# EasyEDA Pro project TC358870 HDMI2MIPI.epro, board PCB12
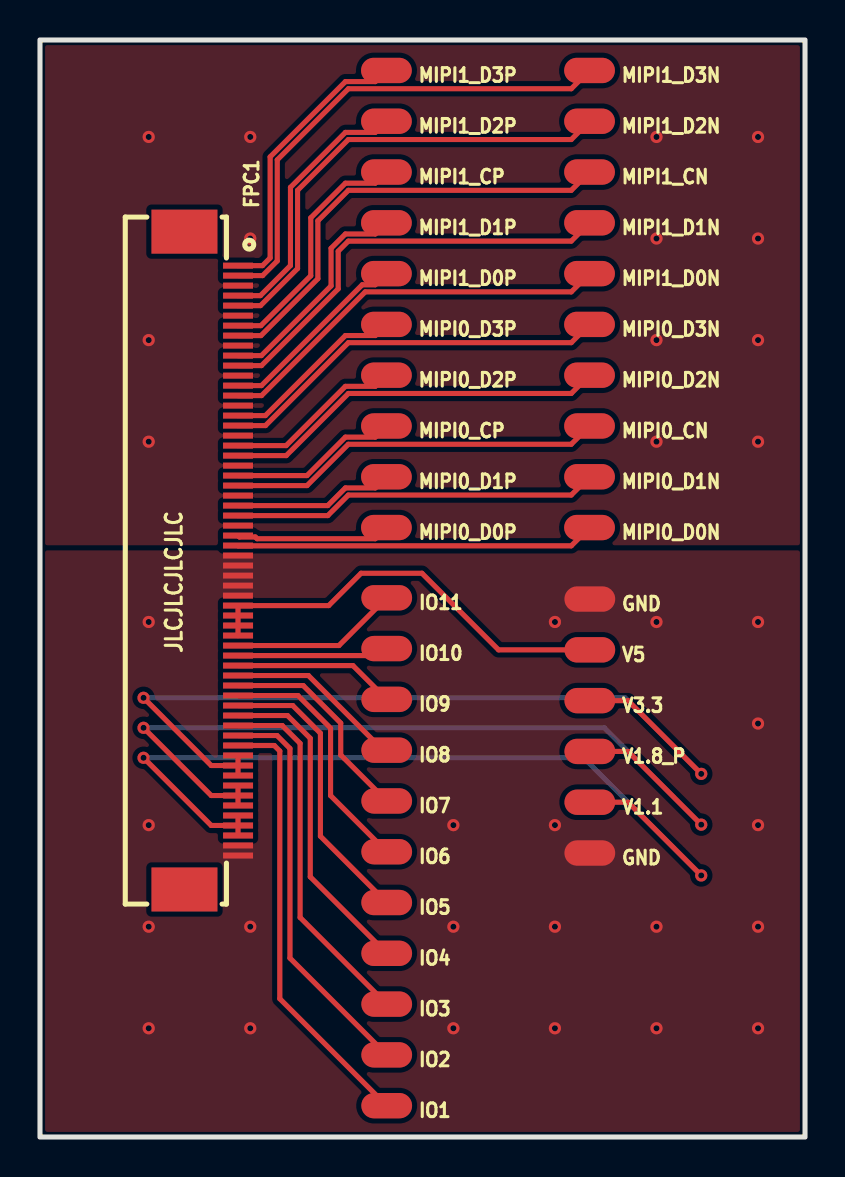
[diagram p6: board, top side]
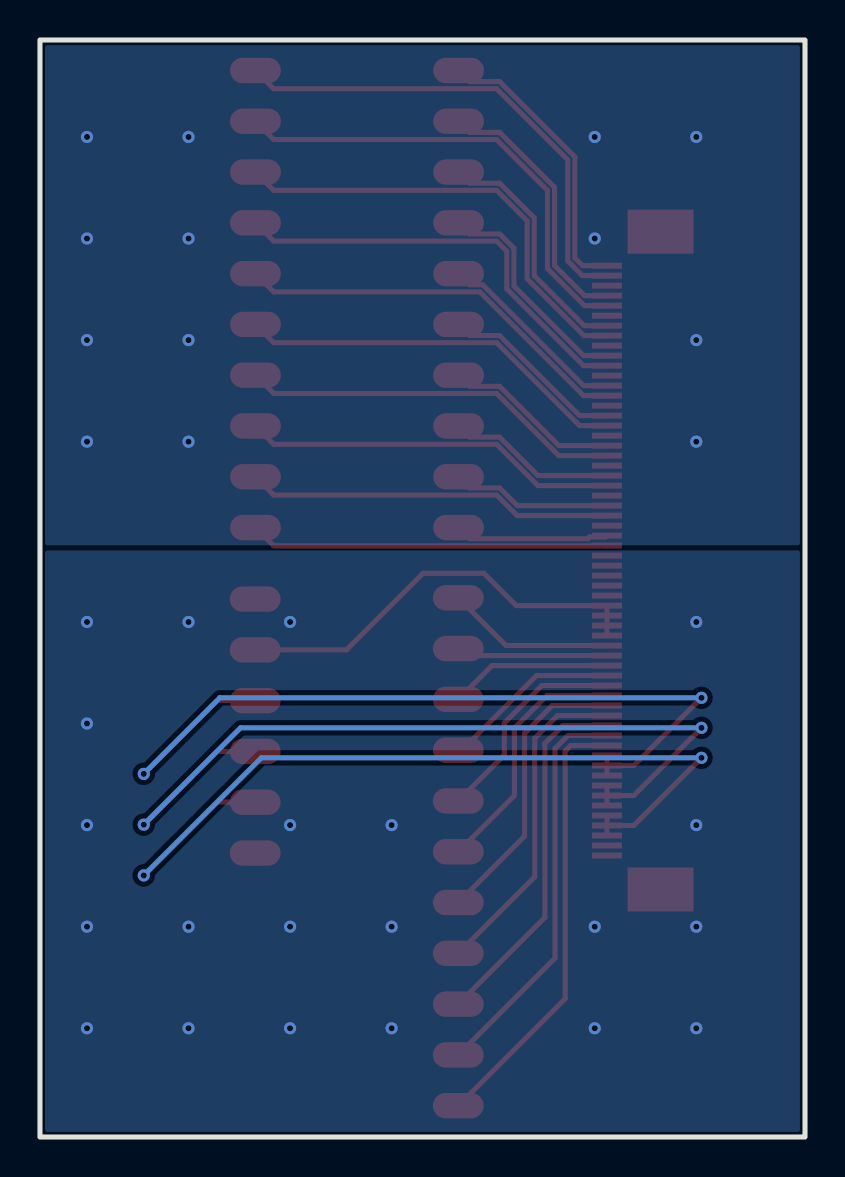
[diagram p7: board, bottom side, seen from below]

Outline 38.27 x 54.86 mm; copper layers: Top Layer, Bottom Layer. Coordinates in mm from the lower left corner of the outline.
Outline path: rectangle 0,54.86 38.27,0
Stack: Top Layer 0.035mm / Dielectric1 1.51mm FR4 er 4.5 / Bottom Layer 0.035mm

## Design rules (mm)
template: 自定义配置
spacing copperThickness1oz (default): track to track 0.102, other pairs 0.152 to 0.3
spacing copperThickness2oz: track to track 0.203, other pairs 0.152 to 0.3
track width copperThickness1oz (default): min 0.127, default 0.254, max 2.54
track width copperThickness2oz: min 0.203, default 0.254, max 2.54
differential pair differentialPair (default): width min 0.127, default 0.254, max 2.54; gap min 0.152, default 0.152
via viaSize (default): diameter min 0.5, default 0.61, max 10; hole min 0.3, default 0.305, max 6.3

## Placement (name value [footprint] x y rotation side)
FPC1  AFC01-S60FCA-00  [FPC-SMD_AFC01-S60FCC-00]  8.57 28.83 270 top
GND  -  [Test-Point-0.5mm]  27.5 26.9 0 top
GND#2  -  [Test-Point-0.5mm]  27.5 14.2 0 top
IO1  -  [Test-Point-0.5mm]  17.34 1.57 0 top
IO2  -  [Test-Point-0.5mm]  17.34 4.11 0 top
IO3  -  [Test-Point-0.5mm]  17.34 6.65 0 top
IO4  -  [Test-Point-0.5mm]  17.34 9.19 0 top
IO5  -  [Test-Point-0.5mm]  17.34 11.73 0 top
IO6  -  [Test-Point-0.5mm]  17.34 14.27 0 top
IO7  -  [Test-Point-0.5mm]  17.34 16.81 0 top
IO8  -  [Test-Point-0.5mm]  17.34 19.35 0 top
IO9  -  [Test-Point-0.5mm]  17.34 21.89 0 top
IO10  -  [Test-Point-0.5mm]  17.34 24.43 0 top
IO11  -  [Test-Point-0.5mm]  17.34 26.97 0 top
MIPI0_CN  -  [Test-Point-0.5mm]  27.49 35.56 0 top
MIPI0_CP  -  [Test-Point-0.5mm]  17.33 35.56 0 top
MIPI0_D0N  -  [Test-Point-0.5mm]  27.49 30.48 0 top
MIPI0_D0P  -  [Test-Point-0.5mm]  17.33 30.48 0 top
MIPI0_D1N  -  [Test-Point-0.5mm]  27.49 33.02 0 top
MIPI0_D1P  -  [Test-Point-0.5mm]  17.33 33.02 0 top
MIPI0_D2N  -  [Test-Point-0.5mm]  27.49 38.1 0 top
MIPI0_D2P  -  [Test-Point-0.5mm]  17.33 38.1 0 top
MIPI0_D3N  -  [Test-Point-0.5mm]  27.49 40.64 0 top
MIPI0_D3P  -  [Test-Point-0.5mm]  17.33 40.64 0 top
MIPI1_CN  -  [Test-Point-0.5mm]  27.49 48.26 0 top
MIPI1_CP  -  [Test-Point-0.5mm]  17.33 48.26 0 top
MIPI1_D0N  -  [Test-Point-0.5mm]  27.49 43.18 0 top
MIPI1_D0P  -  [Test-Point-0.5mm]  17.33 43.18 0 top
MIPI1_D1N  -  [Test-Point-0.5mm]  27.49 45.72 0 top
MIPI1_D1P  -  [Test-Point-0.5mm]  17.33 45.72 0 top
MIPI1_D2N  -  [Test-Point-0.5mm]  27.49 50.8 0 top
MIPI1_D2P  -  [Test-Point-0.5mm]  17.33 50.8 0 top
MIPI1_D3N  -  [Test-Point-0.5mm]  27.49 53.34 0 top
MIPI1_D3P  -  [Test-Point-0.5mm]  17.33 53.34 0 top
V1.1  -  [Test-Point-0.5mm]  27.5 16.74 0 top
V1.8_P  -  [Test-Point-0.5mm]  27.5 19.28 0 top
V3.3  -  [Test-Point-0.5mm]  27.5 21.82 0 top
V5  -  [Test-Point-0.5mm]  27.5 24.36 0 top

## Footprints (pads in the part's own frame, mm; a bottom-side part is the same pattern mirrored in y, then rotated)
FPC-SMD_AFC01-S60FCC-00
  rect 0.3x1.5 smd: 1(-14.75,1.34) 2(-14.251,1.34) 3(-13.751,1.34) 4(-13.25,1.34) 5(-12.75,1.34) 6(-12.249,1.34) 7(-11.749,1.34) 8(-11.25,1.34) 9(-10.751,1.34) 10(-10.251,1.34) 11(-9.75,1.34) 12(-9.249,1.34) 13(-8.749,1.34) 14(-8.25,1.34) 15(-7.75,1.34) 16(-7.25,1.34) 17(-6.75,1.34) 18(-6.25,1.34) 19(-5.75,1.34) 20(-5.249,1.34) 21(-4.749,1.34) 22(-4.251,1.34) 23(-3.751,1.34) 24(-3.25,1.34) 25(-2.75,1.34) 26(-2.249,1.34) 27(-1.749,1.34) 28(-1.25,1.34) 29(-0.751,1.34) 30(-0.251,1.34) 31(0.25,1.34) 32(0.75,1.34) 33(1.25,1.337) 34(1.751,1.337) 35(2.252,1.337) 36(2.749,1.34) 37(3.249,1.34) 38(3.75,1.34) 39(4.25,1.34) 40(4.751,1.34) 41(5.251,1.34) 42(5.749,1.34) 43(6.25,1.34) 44(6.75,1.34) 45(7.25,1.34) 46(7.75,1.34) 47(8.251,1.34) 48(8.75,1.34) 49(9.249,1.34) 50(9.749,1.34) 51(10.25,1.34) 52(10.751,1.34) 53(11.251,1.34) 54(11.751,1.34) 55(12.25,1.34) 56(12.749,1.34) 57(13.249,1.34) 58(13.75,1.34) 59(14.251,1.34) 60(14.751,1.34)
  rect 2.2x3.3 smd: 61(-16.45,-1.34) 62(16.45,-1.34)
Test-Point-0.5mm
  oval 2.54x1.27 smd: 1(0,0)

## Nets
GND: FPC1.30 FPC1.31 FPC1.32 FPC1.33 FPC1.34 FPC1.59 FPC1.60 GND.1 GND#2.1
GND_P: FPC1.3 FPC1.6 FPC1.9 FPC1.12 FPC1.15 FPC1.18 FPC1.21 FPC1.24 FPC1.27
V1.1: FPC1.56 FPC1.57 FPC1.58 V1.1.1
V1.8_P: FPC1.53 FPC1.54 FPC1.55 V1.8_P.1
V3.3: FPC1.50 FPC1.51 FPC1.52 V3.3.1
V5: FPC1.35 FPC1.36 FPC1.37 FPC1.38 V5.1
IO1: FPC1.49 IO1.1
IO2: FPC1.48 IO2.1
IO3: FPC1.47 IO3.1
IO4: FPC1.46 IO4.1
IO5: FPC1.45 IO5.1
IO6: FPC1.44 IO6.1
IO7: FPC1.43 IO7.1
IO8: FPC1.42 IO8.1
IO9: FPC1.41 IO9.1
IO10: FPC1.40 IO10.1
IO11: FPC1.39 IO11.1
MIPI0_CN: FPC1.23 MIPI0_CN.1
MIPI0_CP: FPC1.22 MIPI0_CP.1
MIPI0_D0N: FPC1.29 MIPI0_D0N.1
MIPI0_D0P: FPC1.28 MIPI0_D0P.1
MIPI0_D1N: FPC1.26 MIPI0_D1N.1
MIPI0_D1P: FPC1.25 MIPI0_D1P.1
MIPI0_D2N: FPC1.20 MIPI0_D2N.1
MIPI0_D2P: FPC1.19 MIPI0_D2P.1
MIPI0_D3N: FPC1.17 MIPI0_D3N.1
MIPI0_D3P: FPC1.16 MIPI0_D3P.1
MIPI1_CN: FPC1.8 MIPI1_CN.1
MIPI1_CP: FPC1.7 MIPI1_CP.1
MIPI1_D0N: FPC1.14 MIPI1_D0N.1
MIPI1_D0P: FPC1.13 MIPI1_D0P.1
MIPI1_D1N: FPC1.11 MIPI1_D1N.1
MIPI1_D1P: FPC1.10 MIPI1_D1P.1
MIPI1_D2N: FPC1.5 MIPI1_D2N.1
MIPI1_D2P: FPC1.4 MIPI1_D2P.1
MIPI1_D3N: FPC1.2 MIPI1_D3N.1
MIPI1_D3P: FPC1.1 MIPI1_D3P.1

Pads without a net: FPC1 61 62

## Via types
v1: diameter 0.61, hole 0.305, Top Layer to Bottom Layer, 40 vias

## Routing (per net, layer and track width the routed paths; a pad name or vN(x,y) marks a point on that pad's centre or on a via; arc(x,y) is an arc through that point)
GND:
  vias: v1(5.44,25.76) v1(5.44,15.6) v1(5.44,10.52) v1(5.44,5.44) v1(10.52,10.52) v1(10.52,5.44) v1(20.68,15.6) v1(20.68,10.52) v1(20.68,5.44) v1(25.76,25.76) v1(25.76,15.6) v1(25.76,10.52) v1(25.76,5.44) v1(30.84,25.76) v1(30.84,10.52) v1(30.84,5.44) v1(35.92,25.76) v1(35.92,20.68) v1(35.92,15.6) v1(35.92,10.52) v1(35.92,5.44)
GND_P:
  vias: v1(5.44,50.02) v1(5.44,39.86) v1(5.44,34.78) v1(10.52,50.02) v1(10.52,44.94) v1(30.84,50.02) v1(30.84,44.94) v1(30.84,39.86) v1(30.84,34.78) v1(35.92,50.02) v1(35.92,44.94) v1(35.92,39.86) v1(35.92,34.78)
V1.1: length 44.6
  Top Layer w0.254: v1(33.08,13.08) 29.42,16.74 V1.1.1 ; v1(5.18,18.97) 8.57,15.58 9.91,15.58 ; 9.91,16.08 9.91,15.58 ; 9.91,15.58 9.91,15.08
  Bottom Layer w0.254: v1(5.18,18.97) 27.19,18.97 v1(33.08,13.08)
V1.8_P: length 44.1
  Top Layer w0.254: 9.91,17.08 8.57,17.08 v1(5.18,20.46) ; 9.91,17.08 9.91,16.58 ; 9.91,17.08 9.91,17.58 ; v1(33.08,15.62) 29.42,19.28 V1.8_P.1
  Bottom Layer w0.254: v1(5.18,20.46) 28.23,20.46 v1(33.08,15.62)
V3.3: length 43.7
  Top Layer w0.254: 9.91,18.58 9.91,18.08 ; 9.91,18.58 8.57,18.58 v1(5.18,21.97) ; 9.91,18.58 9.91,19.08 ; V3.3.1 29.42,21.82 v1(33.08,18.16)
  Bottom Layer w0.254: v1(5.18,21.97) 29.27,21.97 v1(33.08,18.16)
V5: length 21.4
  Top Layer w0.254: 9.91,25.08 9.91,26.58 FPC1.35 14.44,26.58 16.06,28.19 19.11,28.19 22.94,24.36 V5.1
IO1: length 22.2
  Top Layer w0.254: IO1.1 12,6.92 12,19.3 11.72,19.58 9.91,19.58
IO2: length 20.2
  Top Layer w0.254: 9.91,20.08 11.86,20.08 12.5,19.43 12.5,8.95 IO2.1
IO3: length 18.3
  Top Layer w0.254: 9.91,20.58 12.12,20.58 13.01,19.69 13.01,10.98 IO3.1
IO4: length 16.4
  Top Layer w0.254: IO4.1 13.52,13.01 13.52,19.94 12.38,21.08 9.91,21.08
IO5: length 14.5
  Top Layer w0.254: 9.91,21.58 12.64,21.58 14.03,20.19 14.03,15.04 IO5.1
IO6: length 12.6
  Top Layer w0.254: IO6.1 14.54,17.08 14.54,20.45 12.9,22.08 9.91,22.08
IO7: length 10.8
  Top Layer w0.254: 9.91,22.58 13.17,22.58 15.04,20.7 15.04,19.11 IO7.1
IO8: length 9
  Top Layer w0.254: 9.91,23.08 13.43,23.08 17.16,19.35 IO8.1
IO9: length 8.1
  Top Layer w0.254: 9.91,23.58 15.65,23.58 IO9.1
IO10: length 7.6
  Top Layer w0.254: IO10.1 16.99,24.08 9.91,24.08
IO11: length 8.4
  Top Layer w0.254: IO11.1 14.96,24.58 9.91,24.58
MIPI0_CN: length 18.8
  Top Layer w0.254: 9.91,32.58 13.36,32.58 15.42,34.65 26.58,34.65 MIPI0_CN.1
MIPI0_CP: length 8.5
  Top Layer w0.254: 9.91,33.08 13.36,33.08 15.28,35 16.77,35 MIPI0_CP.1
MIPI0_D0N: length 18
  Top Layer w0.254: MIPI0_D0N.1 26.58,29.57 9.92,29.57 9.91,29.58
MIPI0_D0P: length 7.7
  Top Layer w0.254: MIPI0_D0P.1 16.77,29.92 10.86,29.92 10.77,30.01 9.98,30.01 9.91,30.08
MIPI0_D1N: length 18.4
  Top Layer w0.254: 9.91,31.08 14.4,31.08 15.42,32.11 26.58,32.11 MIPI0_D1N.1
MIPI0_D1P: length 8
  Top Layer w0.254: 9.91,31.58 14.39,31.58 15.28,32.46 16.77,32.46 MIPI0_D1P.1
MIPI0_D2N: length 19.2
  Top Layer w0.254: MIPI0_D2N.1 26.58,37.19 15.42,37.19 12.32,34.08 9.91,34.08
MIPI0_D2P: length 8.9
  Top Layer w0.254: MIPI0_D2P.1 16.77,37.54 15.28,37.54 12.31,34.58 9.91,34.58
MIPI0_D3N: length 19.7
  Top Layer w0.254: 9.91,35.58 11.28,35.58 15.42,39.73 26.58,39.73 MIPI0_D3N.1
MIPI0_D3P: length 9.3
  Top Layer w0.254: MIPI0_D3P.1 16.77,40.08 15.28,40.08 11.27,36.08 9.91,36.08
MIPI1_CN: length 22.7
  Top Layer w0.254: 9.91,40.08 11.05,40.08 13.9,42.93 13.9,45.82 15.42,47.35 26.58,47.35 MIPI1_CN.1
MIPI1_CP: length 12.3
  Top Layer w0.254: MIPI1_CP.1 16.77,47.7 15.28,47.7 13.54,45.97 13.54,43.07 11.05,40.58 9.91,40.58
MIPI1_D0N: length 20.1
  Top Layer w0.254: MIPI1_D0N.1 26.58,42.27 16.27,42.27 11.08,37.08 9.91,37.08
MIPI1_D0P: length 9.7
  Top Layer w0.254: MIPI1_D0P.1 16.77,42.62 16.12,42.62 11.08,37.58 9.91,37.58
MIPI1_D1N: length 21.6
  Top Layer w0.254: MIPI1_D1N.1 26.58,44.81 15.42,44.81 14.92,44.3 14.92,42.42 11.08,38.58 9.91,38.58
MIPI1_D1P: length 11.3
  Top Layer w0.254: 9.91,39.08 11.07,39.08 14.56,42.57 14.56,44.45 15.28,45.16 16.77,45.16 MIPI1_D1P.1
MIPI1_D2N: length 23.7
  Top Layer w0.254: 9.91,41.58 11.03,41.58 12.88,43.43 12.88,47.35 15.42,49.89 26.58,49.89 MIPI1_D2N.1
MIPI1_D2P: length 13.3
  Top Layer w0.254: MIPI1_D2P.1 16.77,50.24 15.28,50.24 12.53,47.49 12.53,43.58 11.03,42.08 9.91,42.08
MIPI1_D3N: length 24.8
  Top Layer w0.254: 9.91,43.08 11.13,43.08 11.87,43.81 11.87,48.87 15.42,52.43 26.58,52.43 MIPI1_D3N.1
MIPI1_D3P: length 14.4
  Top Layer w0.254: MIPI1_D3P.1 16.77,52.78 15.28,52.78 11.51,49.02 11.51,43.96 11.13,43.58 9.91,43.58

## Copper pours and planes (outline as drawn; the poured copper is in the pictures)
GND on Top Layer: 0,29.34 38.27,29.34 38.27,0 0,0
GND on Bottom Layer: 0,29.34 38.27,29.34 38.27,0 0,0
GND_P on Top Layer: 0,54.86 38.27,54.86 38.27,29.34 0,29.34
GND_P on Bottom Layer: 0,54.86 38.27,54.86 38.27,29.34 0,29.34

## Text on the board
Top Silkscreen Layer: JLCJLCJLCJLC
